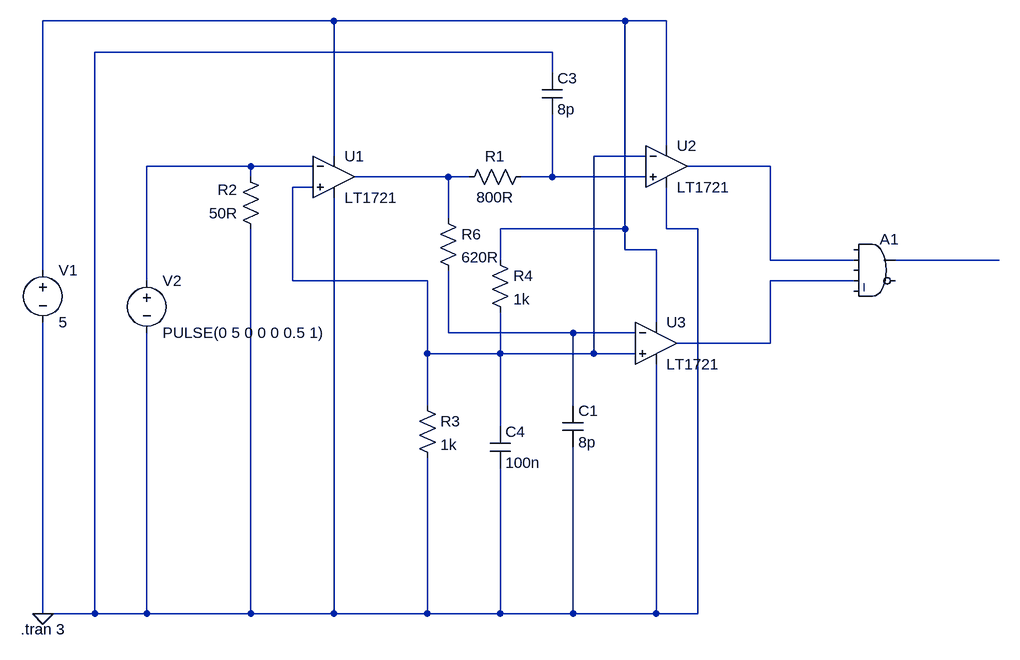
[diagram p0: schematic Draft1.asc]
Draft1.asc, the LTspice schematic file:
Version 4
SHEET 1 980 728
WIRE -48 -224 -496 -224
WIRE 400 -224 -48 -224
WIRE 464 -224 400 -224
WIRE 288 -176 -416 -176
WIRE 288 -144 288 -176
WIRE 464 -32 464 -224
WIRE -48 -16 -48 -224
WIRE 432 -16 352 -16
WIRE -176 0 -336 0
WIRE -80 0 -176 0
WIRE 624 0 496 0
WIRE -176 16 -176 0
WIRE 128 16 -16 16
WIRE 160 16 128 16
WIRE 288 16 288 -80
WIRE 288 16 240 16
WIRE 432 16 288 16
WIRE -80 32 -112 32
WIRE 128 80 128 16
WIRE 400 96 400 -224
WIRE 400 96 208 96
WIRE 464 96 464 32
WIRE 512 96 464 96
WIRE 400 128 400 96
WIRE 448 128 400 128
WIRE 208 144 208 96
WIRE 624 144 624 0
WIRE 752 144 624 144
WIRE 976 144 816 144
WIRE -496 160 -496 -224
WIRE -336 176 -336 0
WIRE -112 176 -112 32
WIRE 96 176 -112 176
WIRE 752 176 624 176
WIRE 448 240 448 128
WIRE 128 256 128 160
WIRE 320 256 128 256
WIRE 416 256 320 256
WIRE 624 272 624 176
WIRE 624 272 480 272
WIRE 96 288 96 176
WIRE 208 288 208 224
WIRE 208 288 96 288
WIRE 352 288 352 -16
WIRE 352 288 208 288
WIRE 416 288 352 288
WIRE 96 368 96 288
WIRE 320 368 320 256
WIRE 208 400 208 288
WIRE -496 688 -496 240
WIRE -416 688 -416 -176
WIRE -416 688 -496 688
WIRE -336 688 -336 256
WIRE -336 688 -416 688
WIRE -176 688 -176 96
WIRE -176 688 -336 688
WIRE -48 688 -48 48
WIRE -48 688 -176 688
WIRE 96 688 96 448
WIRE 96 688 -48 688
WIRE 208 688 208 464
WIRE 208 688 96 688
WIRE 320 688 320 432
WIRE 320 688 208 688
WIRE 448 688 448 304
WIRE 448 688 320 688
WIRE 512 688 512 96
WIRE 512 688 448 688
FLAG -496 688 0
SYMBOL Comparators\\LT1721 -48 -48 R0
SYMATTR InstName U1
SYMBOL Comparators\\LT1721 464 -64 R0
SYMATTR InstName U2
SYMBOL Comparators\\LT1721 448 208 R0
SYMATTR InstName U3
SYMBOL res -160 112 R180
WINDOW 0 36 76 Left 2
WINDOW 3 36 40 Left 2
SYMATTR InstName R2
SYMATTR Value 50R
SYMBOL Digital\\and 784 96 R0
SYMATTR InstName A1
SYMBOL res 144 32 R270
WINDOW 0 32 56 VTop 2
WINDOW 3 0 56 VBottom 2
SYMATTR InstName R1
SYMATTR Value 800R
SYMBOL res 80 352 R0
SYMATTR InstName R3
SYMATTR Value 1k
SYMBOL res 192 128 R0
SYMATTR InstName R4
SYMATTR Value 1k
SYMBOL voltage -496 144 R0
WINDOW 123 0 0 Left 0
WINDOW 39 0 0 Left 0
SYMATTR InstName V1
SYMATTR Value 5
SYMBOL voltage -336 160 R0
WINDOW 123 0 0 Left 0
WINDOW 39 0 0 Left 0
SYMATTR InstName V2
SYMATTR Value PULSE(0 5 0 0 0 0.5 1)
SYMBOL cap 304 368 R0
SYMATTR InstName C1
SYMATTR Value 8p
SYMBOL cap 272 -144 R0
SYMATTR InstName C3
SYMATTR Value 8p
SYMBOL cap 192 400 R0
SYMATTR InstName C4
SYMATTR Value 100n
SYMBOL res 112 64 R0
SYMATTR InstName R6
SYMATTR Value 620R
TEXT -530 712 Left 2 !.tran 3

The netlist it stands for:
* Draft1.asc
XU1 N002 N003 N001 0 N005 LT1720  ; LT1721, pins In+ In- V+ V- OUT
XU2 N006 N002 N001 0 N004 LT1720  ; LT1721, pins In+ In- V+ V- OUT
XU3 N002 N009 N001 0 N008 LT1720  ; LT1721, pins In+ In- V+ V- OUT
R2 0 N003 50R
A1 0 N004 0 N008 0 0 N007 0 AND
R1 N005 N006 800R
R3 N002 0 1k
R4 N001 N002 1k
V1 N001 0 5
V2 N003 0 PULSE(0 5 0 0 0 0.5 1)
C1 N009 0 8p
C3 0 N006 8p
C4 N002 0 100n
R6 N005 N009 620R
.tran 3
.lib LTC.lib
.backanno
.end